# EAGLE design controller v3 (EAGLE 6.4)
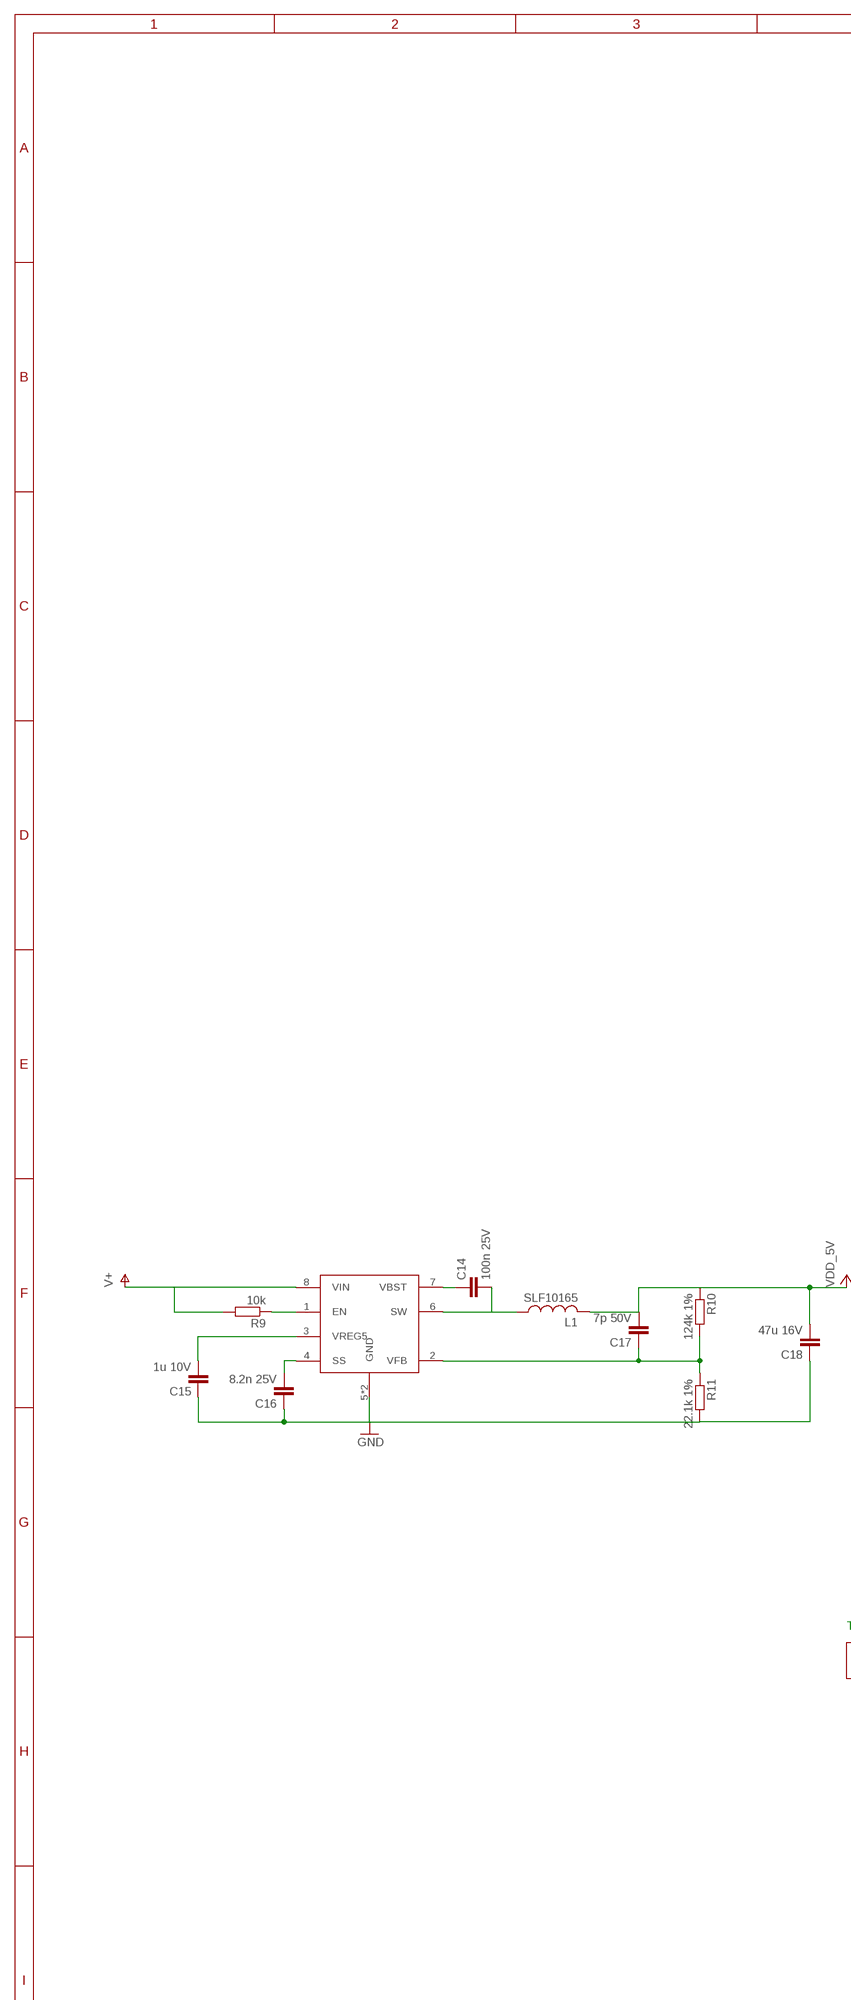
[diagram p0: schematic, sheet 1, part 1 of 2]
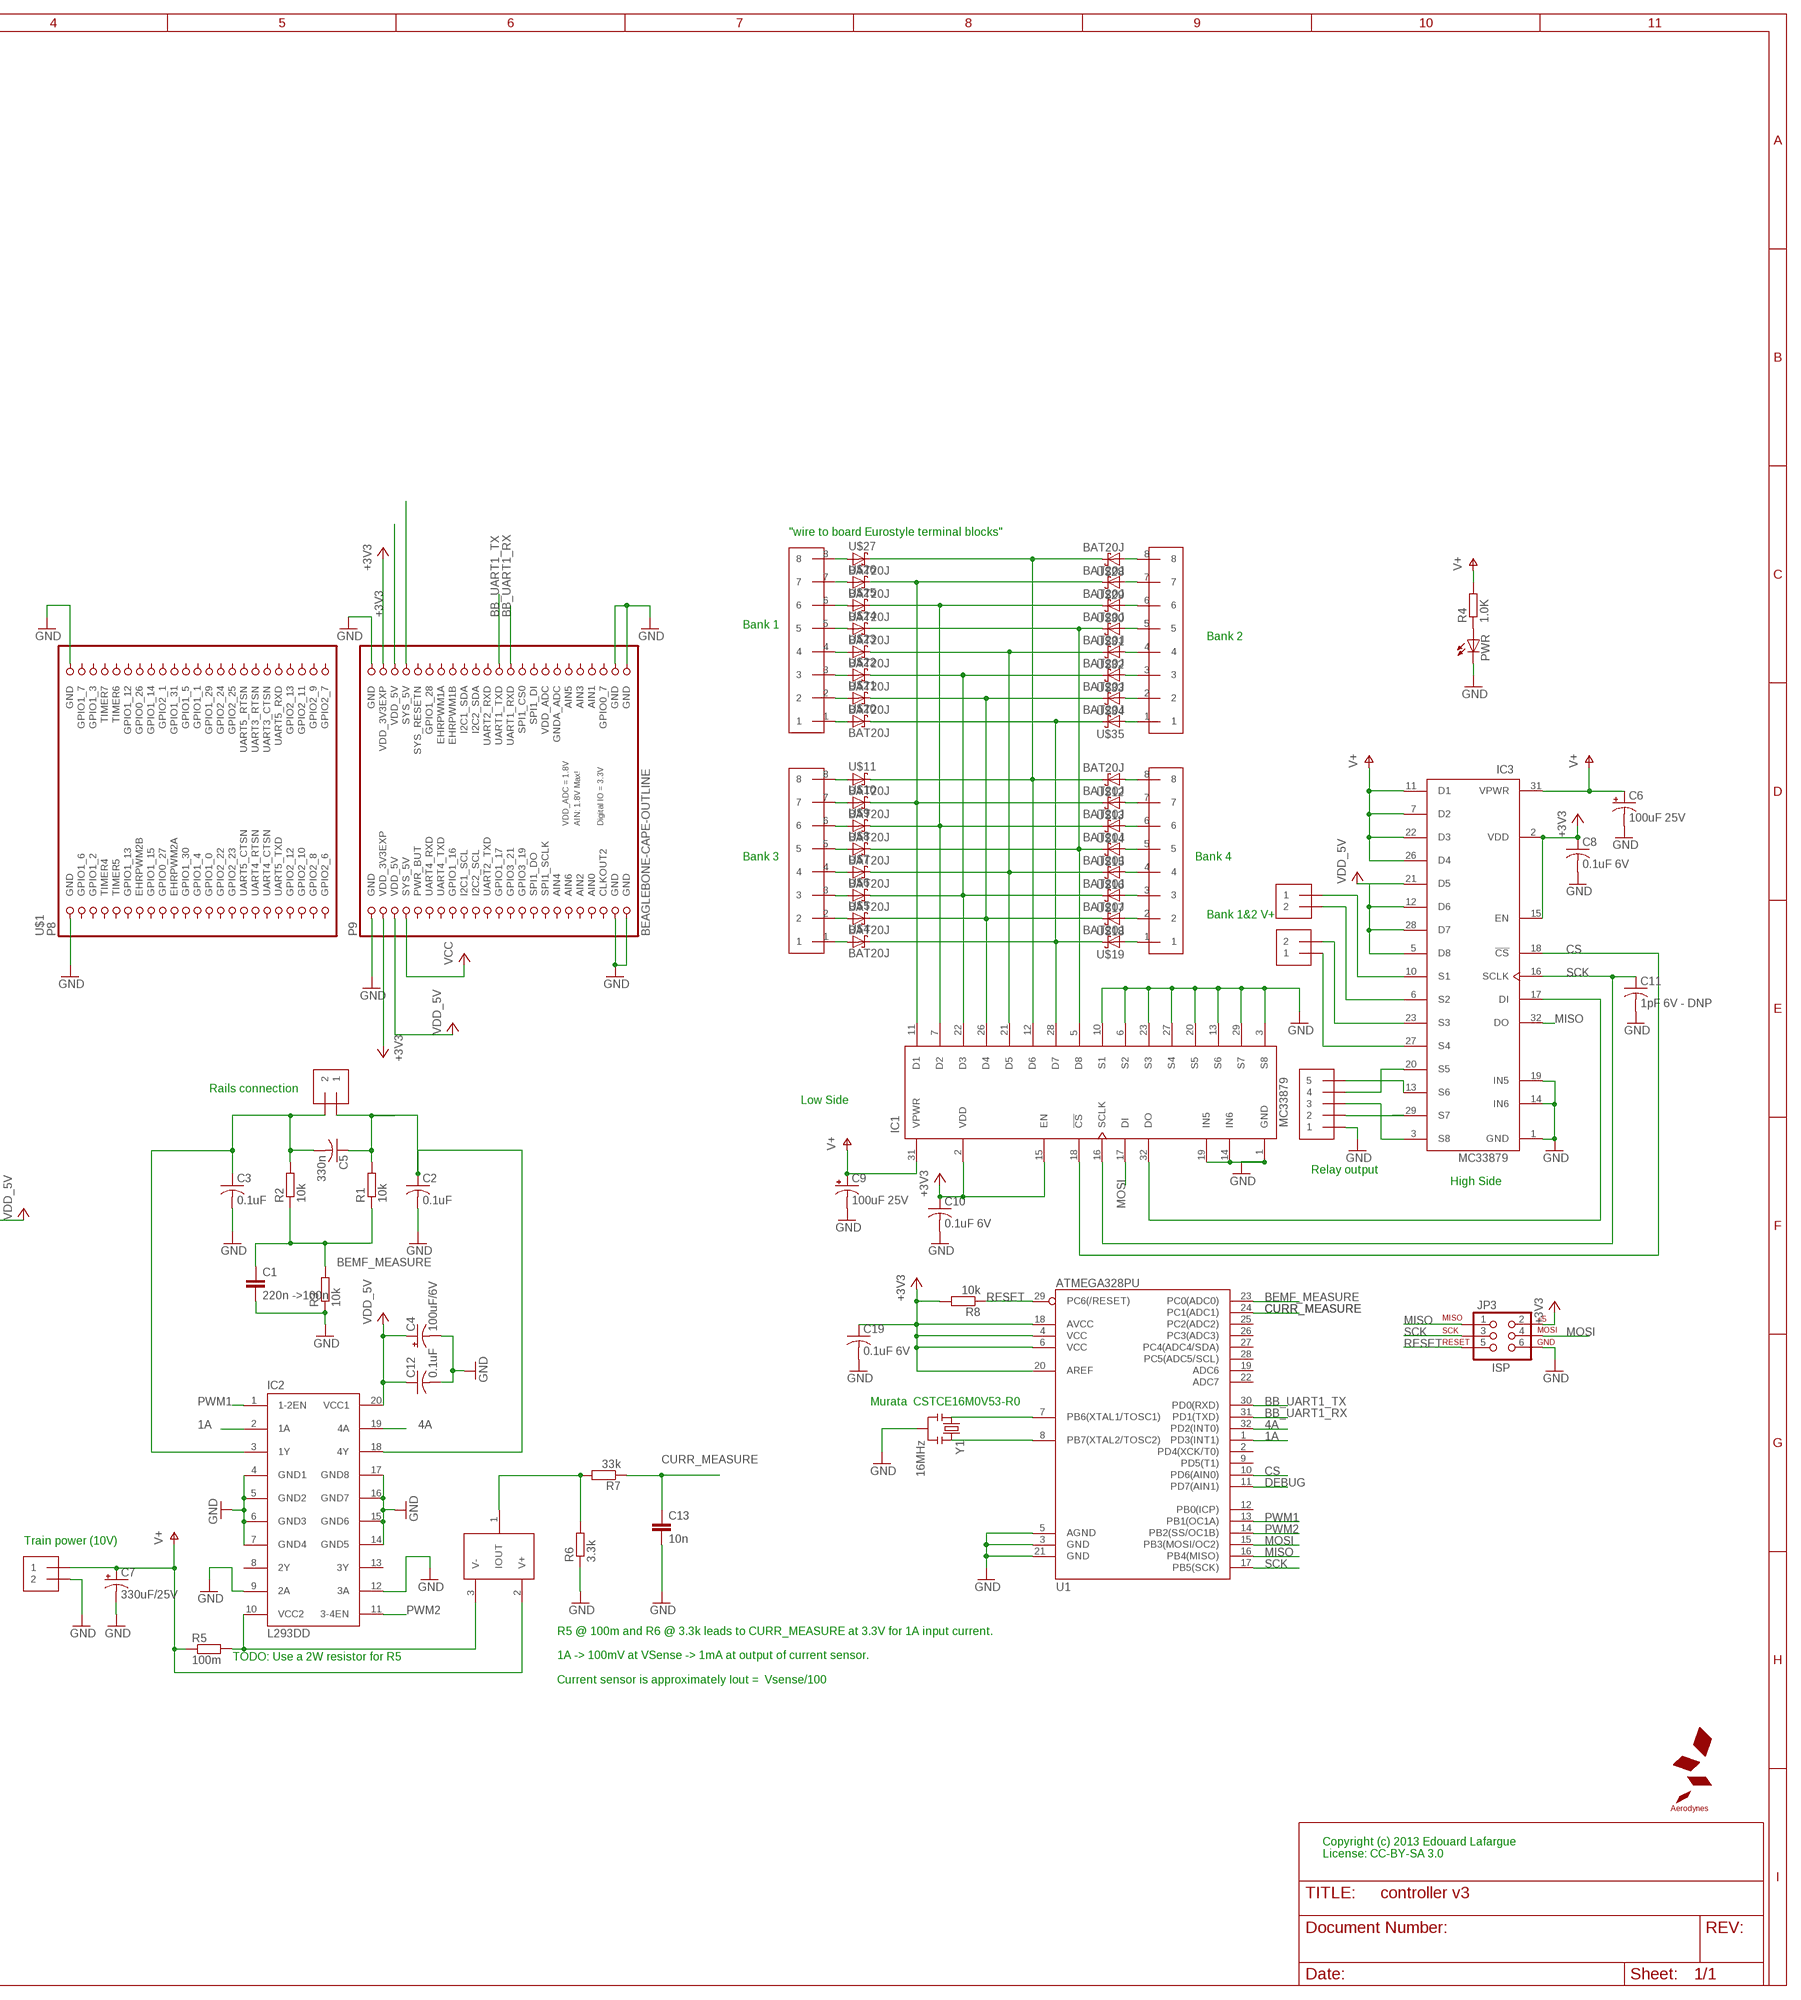
[diagram p1: schematic, sheet 1, part 2 of 2]

## Parts
BANK12  1X2-3.5MM  [1X2-3.5MM]
BANK34  1X2-3.5MM  [1X2-3.5MM]
C1  220n ->100n  C-EUC0805  [C0805]
C2  0.1uF  C-US025-025X050  [C025-025X050]
C3  0.1uF  C-US025-025X050  [C025-025X050]
C4  100uF/6V  CPOL-USE2.5-5  [E2,5-5]
C5  330n  C-US050-025X075  [C050-025X075]
C6  100uF 25V  CPOL-USE2,5-6E  [E2,5-6E]
C7  330uF/25V  CPOL-USE3.5-8  [E3,5-8]
C8  0.1uF 6V  C-US025-025X050  [C025-025X050]
C9  100uF 25V  CPOL-USE2,5-6E  [E2,5-6E]
C10  0.1uF 6V  C-US025-025X050  [C025-025X050]
C11  1pF 6V - DNP  C-USC0805K  [C0805K]
C12  0.1uF  C-US025-025X050  [C025-025X050]
C13  10n  C-EUC0805K  [C0805K]
C14  100n 25V  C-EUC0805K  [C0805K]
C15  1u 10V  C-EUC0603K  [C0603K]
C16  8.2n 25V  C-EUC0603K  [C0603K]
C17  7p 50V  C-EUC0805K  [C0805K]
C18  47u 16V  C-EUC1210K  [C1210K]
C19  0.1uF 6V  C-USC0603K  [C0603K]
CON1  1X08-CONN3.5MM  [1X08-3.5MM]
CON2  1X08-CONN3.5MM  [1X08-3.5MM]
CON3  1X08-CONN3.5MM  [1X08-3.5MM]
CON4  1X08-CONN3.5MM  [1X08-3.5MM]
CUR_SENSE  ZXCT1009-F  [SOT23-1TOP]
IC1  MC33879  [32SOICW-EP-065PITCH]
IC2  L293DD  [SOIC20-2]
IC3  MC33879  [32SOICW-EP-065PITCH]
J1  1X5  [1X05-3.5MM]
JP3  ISP  AVR_SPI_PRG_6PTH  [2X3]
L1  SLF10165  [SLF10165]
PWR  LED3MM  [LED3MM]
R1  10k  R-EU_R0603  [R0603]
R2  10k  R-EU_R0603  [R0603]
R3  10k  R-EU_R0603  [R0603]
R4  1.0K  R-EU_R0603  [R0603]
R5  100m  R-EU_M1206  [M1206]
R6  3.3k  R-EU_R0603  [R0603]
R7  33k  R-EU_R0603  [R0603]
R8  10k  R-EU_R0603  [R0603]
R9  10k  R-EU_R0603  [R0603]
R10  124k 1%  R-EU_R0603  [R0603]
R11  22.1k 1%  R-EU_R0603  [R0603]
SL1  1X2-3.5MM  [1X2-3.5MM]
SL2  1X2-3.5MM  [1X2-3.5MM]
U1  ATMEGA328PU  ATMEGA168  [TQFP32-08]
U$1  BEAGLEBONE-CAPE-OUTLINE  [BEAGLEBONE_NOCUT]
U$2  LOGO-AERODYNESSMALL  [LOGO-AERODYNES-S]
U$4  BAT20J  DIODE-SCHOTTKYSOD-323F  [SOD-323F]
U$5  BAT20J  DIODE-SCHOTTKYSOD-323F  [SOD-323F]
U$6  BAT20J  DIODE-SCHOTTKYSOD-323F  [SOD-323F]
U$7  BAT20J  DIODE-SCHOTTKYSOD-323F  [SOD-323F]
U$8  BAT20J  DIODE-SCHOTTKYSOD-323F  [SOD-323F]
U$9  BAT20J  DIODE-SCHOTTKYSOD-323F  [SOD-323F]
U$10  BAT20J  DIODE-SCHOTTKYSOD-323F  [SOD-323F]
U$11  BAT20J  DIODE-SCHOTTKYSOD-323F  [SOD-323F]
U$12  BAT20J  DIODE-SCHOTTKYSOD-323F  [SOD-323F]
U$13  BAT20J  DIODE-SCHOTTKYSOD-323F  [SOD-323F]
U$14  BAT20J  DIODE-SCHOTTKYSOD-323F  [SOD-323F]
U$15  BAT20J  DIODE-SCHOTTKYSOD-323F  [SOD-323F]
U$16  BAT20J  DIODE-SCHOTTKYSOD-323F  [SOD-323F]
U$17  BAT20J  DIODE-SCHOTTKYSOD-323F  [SOD-323F]
U$18  BAT20J  DIODE-SCHOTTKYSOD-323F  [SOD-323F]
U$19  BAT20J  DIODE-SCHOTTKYSOD-323F  [SOD-323F]
U$20  BAT20J  DIODE-SCHOTTKYSOD-323F  [SOD-323F]
U$21  BAT20J  DIODE-SCHOTTKYSOD-323F  [SOD-323F]
U$22  BAT20J  DIODE-SCHOTTKYSOD-323F  [SOD-323F]
U$23  BAT20J  DIODE-SCHOTTKYSOD-323F  [SOD-323F]
U$24  BAT20J  DIODE-SCHOTTKYSOD-323F  [SOD-323F]
U$25  BAT20J  DIODE-SCHOTTKYSOD-323F  [SOD-323F]
U$26  BAT20J  DIODE-SCHOTTKYSOD-323F  [SOD-323F]
U$27  BAT20J  DIODE-SCHOTTKYSOD-323F  [SOD-323F]
U$28  BAT20J  DIODE-SCHOTTKYSOD-323F  [SOD-323F]
U$29  BAT20J  DIODE-SCHOTTKYSOD-323F  [SOD-323F]
U$30  BAT20J  DIODE-SCHOTTKYSOD-323F  [SOD-323F]
U$31  BAT20J  DIODE-SCHOTTKYSOD-323F  [SOD-323F]
U$32  BAT20J  DIODE-SCHOTTKYSOD-323F  [SOD-323F]
U$33  BAT20J  DIODE-SCHOTTKYSOD-323F  [SOD-323F]
U$34  BAT20J  DIODE-SCHOTTKYSOD-323F  [SOD-323F]
U$35  BAT20J  DIODE-SCHOTTKYSOD-323F  [SOD-323F]
U$36  TPS54327DDA  [SOIC8-DDA]
Y1  16MHz  RESONATOR16MHZ  [RESONATOR-SMD]

## Nets
1A: IC2.2(1A) U1.1(PD3(INT1))
1Y: C3.1 C5.2 IC2.3(1Y) R2.2 SL1.2
4A: IC2.19(4A) U1.32(PD2(INT0))
4Y: C2.1 C5.1 IC2.18(4Y) R1.2 SL1.1
+3V3: C8.1 C10.1 C19.1 IC1.2(VDD) IC1.15(EN) IC3.2(VDD) IC3.15(EN) JP3.2 R8.2 U1.4(VCC) U1.6(VCC) U1.18(AVCC) U1.20(AREF) U$1.P9-3(VDD_3V3EXP) U$1.P9-4(VDD_3V3EXP)
BB_UART1_RX: U1.31(PD1(TXD)) U$1.P9-26(UART1_RXD)
BB_UART1_TX: U1.30(PD0(RXD)) U$1.P9-24(UART1_TXD)
BEMF_MEASURE: C1.1 R1.1 R2.1 R3.2 U1.23(PC0(ADC0))
CS: IC1.18(!CS) IC3.18(!CS) U1.10(PD6(AIN0))
CURR_MEASURE: C13.1 R7.1 U1.24(PC1(ADC1))
DEBUG: U1.11(PD7(AIN1))
GND: C1.2 C2.2 C3.2 C4.- C6.- C7.- C8.2 C9.- C10.2 C11.2 C12.2 C13.2 C15.1 C16.1 C18.1 C19.2 IC1.1(GND) IC1.3(S8) IC1.6(S2) IC1.10(S1) IC1.13(S6) IC1.14(IN6) IC1.19(IN5) IC1.20(S5) IC1.23(S3) IC1.27(S4) IC1.29(S7) IC2.4(GND1) IC2.5(GND2) IC2.6(GND3) IC2.7(GND4) IC2.9(2A) IC2.12(3A) IC2.14(GND5) IC2.15(GND6) IC2.16(GND7) IC2.17(GND8) IC3.1(GND) IC3.14(IN6) IC3.19(IN5) J1.1 JP3.6 PWR.K(C) R3.1 R6.1 R11.2 SL2.2 U1.3(GND) U1.5(AGND) U1.21(GND) U$1.P8-1(GND) U$1.P8-2(GND) U$1.P9-1(GND) U$1.P9-2(GND) U$1.P9-43(GND) U$1.P9-44(GND) U$1.P9-45(GND) U$1.P9-46(GND) U$36.5(GND) U$36.PAD(GND) Y1.2
MISO: IC3.32(DO) JP3.1 U1.16(PB4(MISO))
MOSI: IC1.17(DI) JP3.4 U1.15(PB3(MOSI/OC2))
N$1: BANK34.1 IC3.27(S4)
N$2: BANK34.2 IC3.23(S3)
N$3: BANK12.2 IC3.6(S2)
N$4: BANK12.1 IC3.10(S1)
N$5: CUR_SENSE.3(V-) IC2.10(VCC2) R5.2
N$6: CUR_SENSE.1(IOUT) R6.2 R7.2
N$7: IC1.22(D3) U$6.C U$17.C U$22.C U$33.C
N$8: IC1.21(D5) U$7.C U$16.C U$23.C U$32.C
N$9: IC1.5(D8) U$8.C U$15.C U$24.C U$31.C
N$10: CON3.3 U$6.A
N$11: IC1.28(D7) U$4.C U$19.C U$20.C U$35.C
N$12: IC1.12(D6) U$11.C U$12.C U$27.C U$28.C
N$13: IC1.32(DO) IC3.17(DI)
N$14: IC1.11(D1) U$10.C U$13.C U$26.C U$29.C
N$15: IC1.26(D4) U$5.C U$18.C U$21.C U$34.C
N$16: IC1.7(D2) U$9.C U$14.C U$25.C U$30.C
N$17: IC3.20(S5) J1.4
N$18: CON3.2 U$5.A
N$19: CON3.1 U$4.A
N$20: CON3.8 U$11.A
N$21: CON3.7 U$10.A
N$22: CON3.6 U$9.A
N$23: CON3.5 U$8.A
N$24: CON3.4 U$7.A
N$25: CON4.8 U$12.A
N$26: CON4.7 U$13.A
N$27: CON4.6 U$14.A
N$28: CON4.5 U$15.A
N$29: CON4.4 U$16.A
N$30: CON4.3 U$17.A
N$31: CON4.2 U$18.A
N$32: CON4.1 U$19.A
N$33: CON1.8 U$27.A
N$34: CON1.7 U$26.A
N$35: PWR.A R4.1
N$36: CON1.6 U$25.A
N$37: CON1.5 U$24.A
N$38: CON1.4 U$23.A
N$39: CON1.3 U$22.A
N$40: CON1.2 U$21.A
N$41: CON1.1 U$20.A
N$42: CON2.8 U$28.A
N$43: CON2.7 U$29.A
N$44: CON2.6 U$30.A
N$45: CON2.5 U$31.A
N$46: CON2.4 U$32.A
N$47: CON2.3 U$33.A
N$48: CON2.2 U$34.A
N$49: CON2.1 U$35.A
N$50: IC3.13(S6) J1.5
N$53: IC3.29(S7) J1.2
N$54: IC3.3(S8) J1.3
N$55: U1.7(PB6(XTAL1/TOSC1)) Y1.1
N$56: U1.8(PB7(XTAL2/TOSC2)) Y1.3
N$58: R9.1 U$36.1(EN)
N$59: C14.1 U$36.7(VBST)
N$60: C16.2 U$36.4(SS)
N$61: C14.2 L1.P$1 U$36.6(SW)
N$63: C15.2 U$36.3(VREG5)
N$65: C17.1 R10.2 R11.1 U$36.2(VFB)
PWM1: IC2.1(1-2EN) U1.13(PB1(OC1A))
PWM2: IC2.11(3-4EN) U1.14(PB2(SS/OC1B))
RESET: JP3.5 R8.1 U1.29(PC6(/RESET))
SCK: C11.1 IC1.16(SCLK) IC3.16(SCLK) JP3.3 U1.17(PB5(SCK))
SYS_5V: U$1.P9-7(SYS_5V) U$1.P9-8(SYS_5V) ; supply symbol labelled VCC
V+: C6.+ C7.+ C9.+ CUR_SENSE.2(V+) IC1.31(VPWR) IC3.7(D2) IC3.11(D1) IC3.22(D3) IC3.26(D4) IC3.31(VPWR) R4.2 R5.1 R9.2 SL2.1 U$36.8(VIN)
VDD_5V: C4.+ C12.1 C17.2 C18.2 IC2.20(VCC1) IC3.5(D8) IC3.12(D6) IC3.21(D5) IC3.28(D7) L1.P$2 R10.1 U$1.P9-5(VDD_5V) U$1.P9-6(VDD_5V)
Unconnected: IC2.8(2Y) IC2.13(3Y) U1.2(PD4(XCK/T0)) U1.9(PD5(T1)) U1.12(PB0(ICP)) U1.19(ADC6) U1.22(ADC7) U1.25(PC2(ADC2)) U1.26(PC3(ADC3)) U1.27(PC4(ADC4/SDA)) U1.28(PC5(ADC5/SCL)) U$1.P8-3(GPIO1_6) U$1.P8-4(GPIO1_7) U$1.P8-5(GPIO1_2) U$1.P8-6(GPIO1_3) U$1.P8-7(TIMER4) U$1.P8-8(TIMER7) U$1.P8-9(TIMER5) U$1.P8-10(TIMER6) U$1.P8-11(GPIO1_13) U$1.P8-12(GPIO1_12) U$1.P8-13(EHRPWM2B) U$1.P8-14(GPIO0_26) U$1.P8-15(GPIO1_15) U$1.P8-16(GPIO1_14) U$1.P8-17(GPIO0_27) U$1.P8-18(GPIO2_1) U$1.P8-19(EHRPWM2A) U$1.P8-20(GPIO1_31) U$1.P8-21(GPIO1_30) U$1.P8-22(GPIO1_5) U$1.P8-23(GPIO1_4) U$1.P8-24(GPIO1_1) U$1.P8-25(GPIO1_0) U$1.P8-26(GPIO1_29) U$1.P8-27(GPIO2_22) U$1.P8-28(GPIO2_24) U$1.P8-29(GPIO2_23) U$1.P8-30(GPIO2_25) U$1.P8-31(UART5_CTSN) U$1.P8-32(UART5_RTSN) U$1.P8-33(UART4_RTSN) U$1.P8-34(UART3_RTSN) U$1.P8-35(UART4_CTSN) U$1.P8-36(UART3_CTSN) U$1.P8-37(UART5_TXD) U$1.P8-38(UART5_RXD) U$1.P8-39(GPIO2_12) U$1.P8-40(GPIO2_13) U$1.P8-41(GPIO2_10) U$1.P8-42(GPIO2_11) U$1.P8-43(GPIO2_8) U$1.P8-44(GPIO2_9) U$1.P8-45(GPIO2_6) U$1.P8-46(GPIO2_7) U$1.P9-9(PWR_BUT) U$1.P9-10(SYS_RESETN) U$1.P9-11(UART4_RXD) U$1.P9-12(GPIO1_28) U$1.P9-13(UART4_TXD) U$1.P9-14(EHRPWM1A) U$1.P9-15(GPIO1_16) U$1.P9-16(EHRPWM1B) U$1.P9-17(I2C1_SCL) U$1.P9-18(I2C1_SDA) U$1.P9-19(I2C2_SCL) U$1.P9-20(I2C2_SDA) U$1.P9-21(UART2_TXD) U$1.P9-22(UART2_RXD) U$1.P9-23(GPIO1_17) U$1.P9-25(GPIO3_21) U$1.P9-27(GPIO3_19) U$1.P9-28(SPI1_CS0) U$1.P9-29(SPI1_DO) U$1.P9-30(SPI1_DI) U$1.P9-31(SPI1_SCLK) U$1.P9-33(AIN4) U$1.P9-35(AIN6) U$1.P9-36(AIN5) U$1.P9-37(AIN2) U$1.P9-38(AIN3) U$1.P9-39(AIN0) U$1.P9-40(AIN1) U$1.P9-41(CLKOUT2) U$1.P9-42(GPIO0_7)

## Notes on the sheet
- "wire to board Eurostyle terminal blocks"
- Bank 1
- Bank 2
- Bank 3 | Bank 4
- Bank 1&2 V+
- Rails connection
- Low Side
- Relay output
- High Side
- Murata  CSTCE16M0V53-R0
- Train power (10V)
- TODO: Use a 2W resistor for R5
- R5 @ 100m and R6 @ 3.3k leads to CURR_MEASURE at 3.3V for 1A input current.
  
  1A -> 100mV at VSense -> 1mA at output of current sensor.
  
  Current sensor is approximately Iout = 	Vsense/100
- Copyright (c) 2013 Edouard Lafargue
  License: CC-BY-SA 3.0

## Power pins joined to a net without a drawn wire
GNDA_ADC: U$1.P9-34(GNDA_ADC)
VDD_ADC: U$1.P9-32(VDD_ADC)

## Library data of the parts
BANK12 BANK34 SL1 SL2 = adafruit:1X2: 3.5mm Terminal block http://www.ladyada.net/library/pcb/eaglelibrary.html
C1 C13-C18 = resistor:C-EU: CAPACITOR, European symbol
C2 C3 C8 C10-C12 C19 = rcl-ez:C-US: CAPACITOR, American symbol
C4 = adafruit:CPOL-US: POLARIZED CAPACITOR, American symbol
C5 = adafruit:C-US: CAPACITOR, American symbol
C6 C9 = rcl:CPOL-US: POLARIZED CAPACITOR, American symbol
C7 = rcl-ez:CPOL-US: POLARIZED CAPACITOR, American symbol
CON1-CON4 = aerodynes:1X08-CONN: Generic 3.5mm pitch screw connector, 8 plots.
CUR_SENSE = aerodynes:ZXCT1009: The ZXCT1009 is a high side current sense monitor. Using this device eliminates the need to disrupt the ground plane when sensing a load current. It takes a high side voltage developed across a current shunt resistor and translates it into a proportional output current. A user defined output resistor scales the output current into a ground-referenced voltage. The wide input voltage range of 20V down to as low as 2.5V make it suitable for a range of applications. A minimum operating current of just 4µA, combined with a SOT23 package make it a unique solution for portable battery equipment. The SM8 device offers an alternative package option. http://www.diodes.com/datasheets/ZXCT1009.pdf
IC1 IC3 = aerodynes:MC33879
IC2 = aerodynes:L293D: The Device is a monolithic integrated high voltage, high current four channel driver designed to accept standard DTL or TTL logic levels and drive inductive loads (such as relays solenoides, DC and stepping motors) and switching power transistors. To simplify use as two bridges each pair of channels is equipped with an enable input. A separate supply input is provided for the logic, allowing operation at a lower voltage and internal clamp diodes are included. This device is suitable for use in switching applications at frequencies up to 5 kHz.
J1 = adafruit:1X5
JP3 = SparkFun:AVR_SPI_PRG_6: AVR ISP 6 Pin This is the reduced ISP connector for AVR programming. Common on Arduino. This footprint will take up less PCB space and can be used with a 10-pin to 6-pin adapter such as SKU: BOB-08508
L1 = aerodynes:SLF10165
PWR = minimidi:LED: LED OSRAM: - CHIPLED LG R971, LG N971, LY N971, LG Q971, LY Q971, LO R971, LY R971 LH N974, LH R974 LS Q976, LO Q976, LY Q976 LO Q996 - Hyper CHIPLED LW Q18S LB Q993, LB Q99A, LB R99A - SideLED LS A670, LO A670, LY A670, LG A670, LP A670 LB A673, LV A673, LT A673, LW A673 LH A674 LY A675 LS A676, LA A676, LO A676, LY A676, LW A676 LS A679, LY A679, LG A679 - Hyper Micro SIDELED® LS Y876, LA Y876, LO Y876, LY Y876 LT Y87S - SmartLED LW L88C, LW L88S LB L89C, LB L89S, LG L890 LS L89K, LO L89K, LY L89K LS L896, LA L896, LO L896, LY L896 - TOPLED LS T670, LO T670, LY T670, LG T670, LP T670 LSG T670, LSP T670, LSY T670, LOP T670, LYG T670 LG T671, LOG T671, LSG T671 LB T673, LV T673, LT T673, LW T673 LH T674 LS T676, LA T676, LO T676, LY T676, LB T676, LH T676, LSB T676, LW T676 LB T67C, LV T67C, LT T67C, LS T67K, LO T67K, LY T67K, LW E67C LS E67B, LA E67B, LO E67B, LY E67B, LB E67C, LV E67C, LT E67C LW T67C LS T679, LY T679, LG T679 LS T770, LO T770, LY T770, LG T770, LP T770 LB T773, LV T773, LT T773, LW T773 LH T774 LS E675, LA E675, LY E675, LS T675 LS T776, LA T776, LO T776, LY T776, LB T776 LHGB T686 LT T68C, LB T68C - Hyper Mini TOPLED® LB M676 - Mini TOPLED Santana® LG M470 LS M47K, LO M47K, LY M47K Source: http://www.osram.convergy.de/
R1-R11 = resistor:R-EU_: RESISTOR, European symbol
U1 = SparkFun:ATMEGA168
U$1 = aerodynes:BEAGLEBONE-CAPE
U$2 = aerodynes:LOGO-AERODYNES
U$4-U$35 = aerodynes:DIODE-SCHOTTKY: Various Schottky diodes used in Aerodynes projects
U$36 = aerodynes:TPS54327: 3-A OUTPUT SINGLE SYNCHRONOUS STEP DOWN SWITCHER WITH INTEGRATED FET (SWIFTTM ) The TPS54327 is an adaptive on-time D-CAP2™ mode synchronous buck converter.
Y1 = SparkFun-FreqCtrl:RESONATOR: Resonator Small SMD resonator. Used, eg, on the Arduino Pro/ Pro Mini boards. 8MHz- XTAL-08895 16MHz- XTAL-08900; PROD_ID: XTAL-08900

## Net classes
0 Default: width 0.254 mm
1 power: width 0.61 mm

## Board
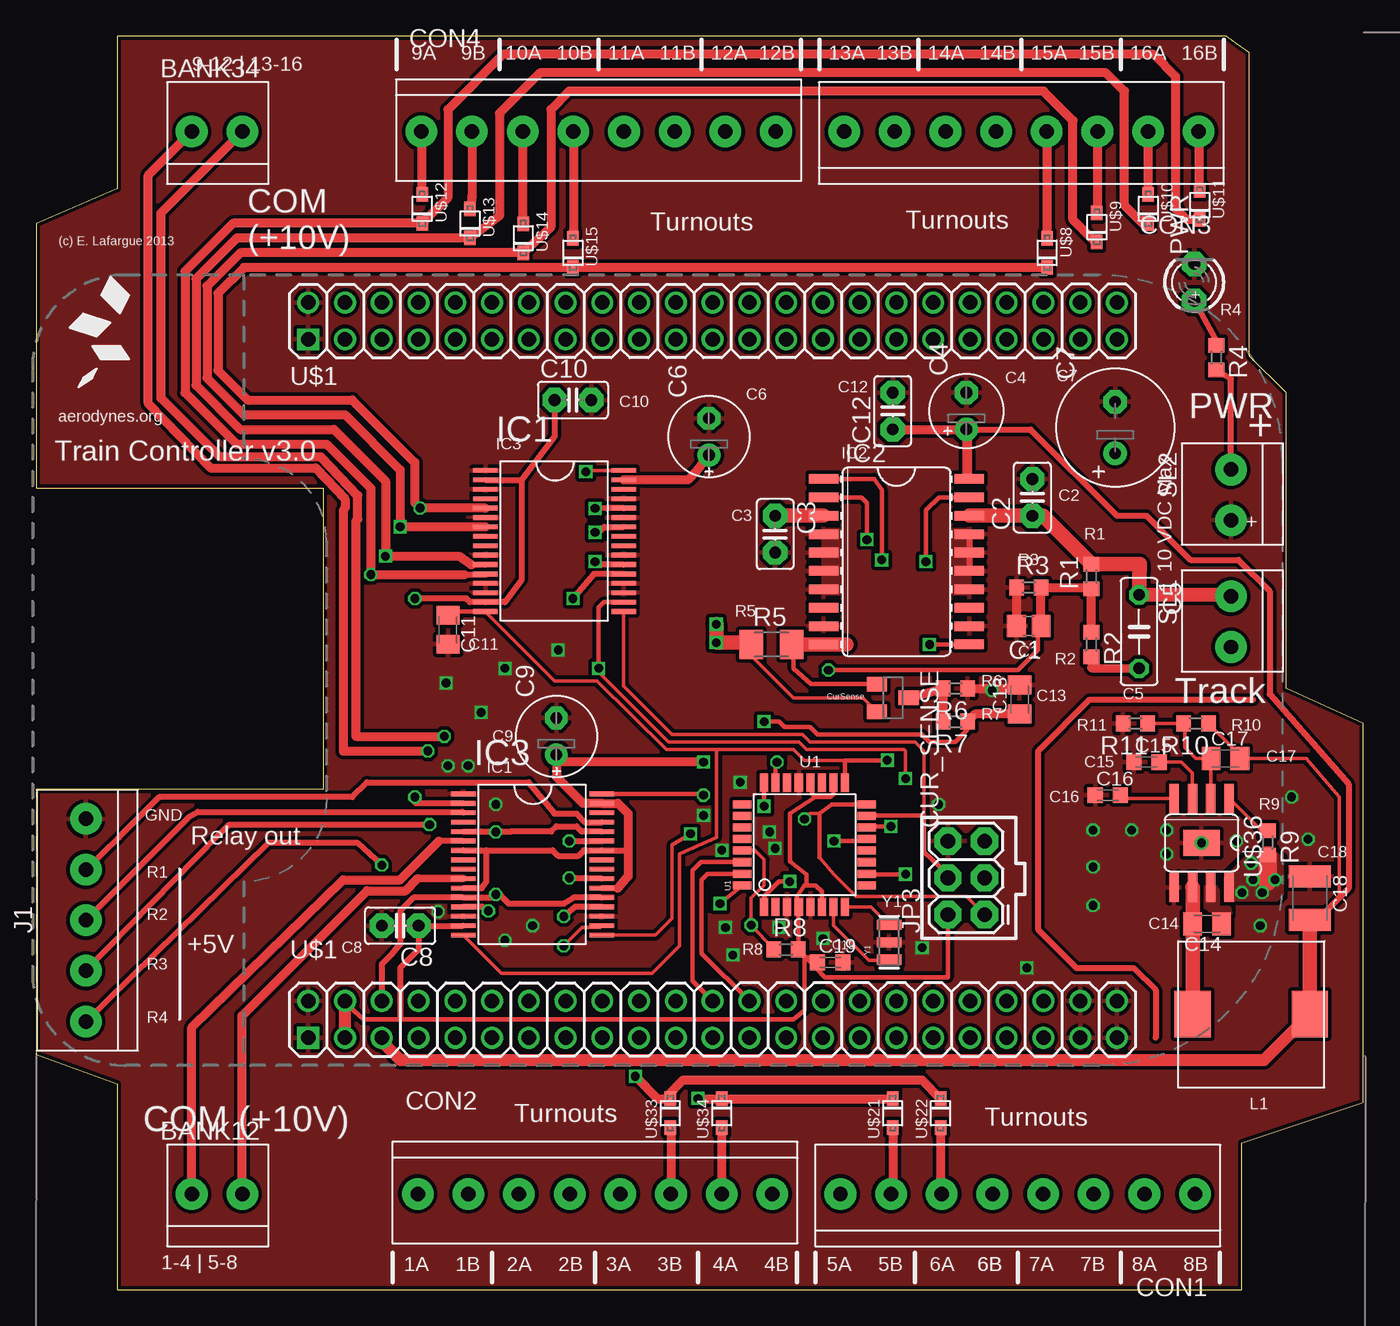
[diagram p2: board, top side]
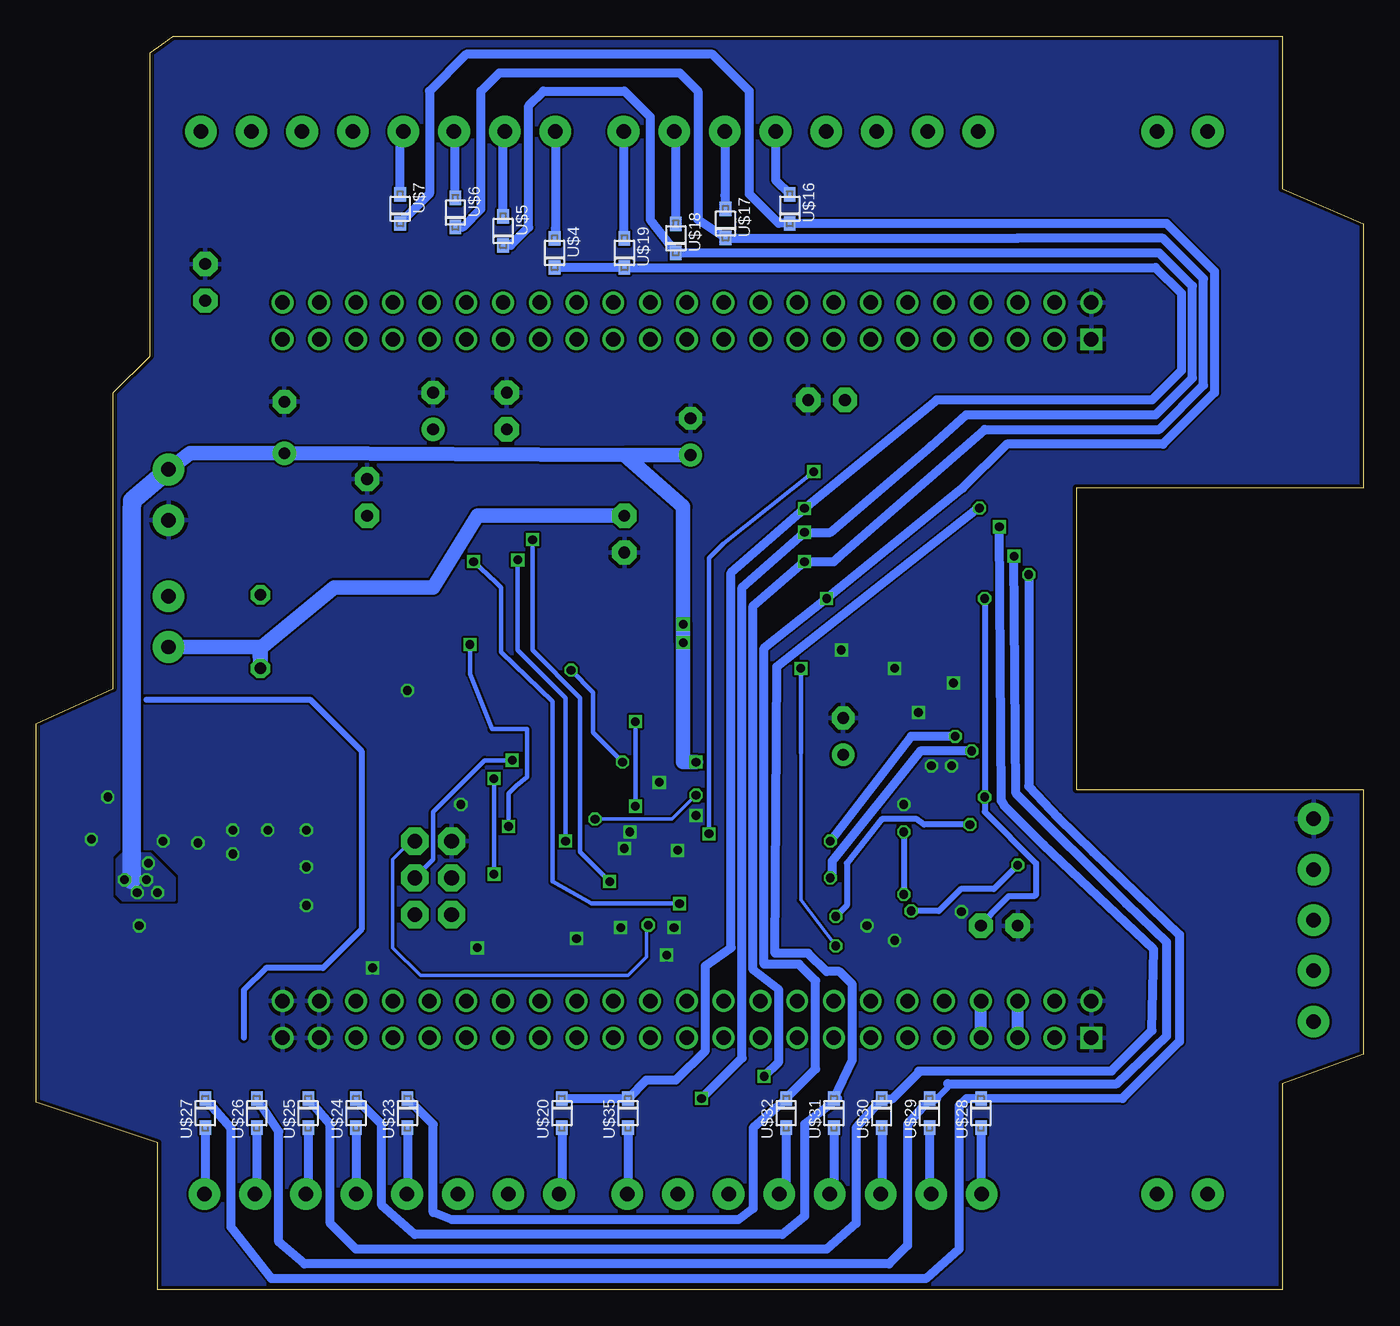
[diagram p3: board, bottom side, seen from below]

Size 91.69 x 86.6 mm. Coordinates in mm from the lower left corner, seen from the top.
Outline: 5.59,0 83.31,0 83.31,10.16 91.69,12.95 91.69,39.12 86.36,41.53 86.36,61.98 83.82,64.52 83.82,85.47 82.98,86.05 82.22,86.6 5.59,86.6 5.59,76.07 0,73.66 0,55.37 19.81,55.37 19.81,34.54 0,34.54 0,16.26 5.59,14.22 5.59,0
Copper layers (1*16): Top 0.035mm / dielectric 1.5mm / Bottom 0.035mm
Design rules "Fusion_eagle_rule_v1.1": minimum track width 6mil, minimum drill 12mil, track to track 6mil, track to pad 6mil, pad to pad 6mil, via to via 6mil, smd to smd 0mil, copper to edge 10mil, drill to drill 10mil, minimum pad ring 10mil, minimum via ring 6mil, stop-mask expansion 2mil, vias tented up to drill 100mil, thermal gap 10mil

### Footprints (pad centres in the part's own frame; a part is rotated, then mirrored left to right if it is on the bottom)
1X2-3.5MM = drill 1 pad 2.184: 1 1.8,0; 2 -1.7,0
C0805 = smd 1.3 x 1.5: 1 -0.85,0; 2 0.85,0
C025-025X050 = drill 0.813 pad 1.676 octagon: 1 -1.27,0; 2 1.27,0
E2,5-5 = drill 0.813 pad 1.6: + -1.27,0 | drill 0.813 pad 1.6 octagon: - 1.27,0
C050-025X075 = drill 0.813 octagon: 1 -2.54,0; 2 2.54,0
E2,5-6E = drill 0.813 pad 1.575: + -1.27,0 | drill 0.813 pad 1.575 octagon: - 1.27,0
E3,5-8 = drill 0.813 pad 1.6: + -1.778,0 | drill 0.813 pad 1.6 octagon: - 1.778,0
C0805K = smd 1.3 x 1.6: 1 -1,0; 2 1,0
C0603K = smd 1.05 x 1.08: 1 -0.875,0; 2 0.875,0
C1210K = smd 1.5 x 2.9: 1 -1.5,0; 2 1.5,0
1X08-3.5MM = drill 1 pad 2.184: 1 -12.25,0; 2 -8.75,0; 3 -5.25,0; 4 -1.75,0; 5 1.75,0; 6 5.25,0; 7 8.75,0; 8 12.25,0
SOT23-1TOP = smd 1 x 1.4: 1 0,1.1; 2 0.95,-1.1; 3 -0.95,-1.1
32SOICW-EP-065PITCH = smd 0.325 x 1.7: 1 -9.1,-4.78; 2 -8.45,-4.78; 3 -7.8,-4.78; 4 -7.15,-4.78; 5 -6.5,-4.78; 6 -5.85,-4.78; 7 -5.2,-4.78; 8 -4.55,-4.78; 9 -3.9,-4.78; 10 -3.25,-4.78; 11 -2.6,-4.78; 12 -1.95,-4.78; 13 -1.3,-4.78; 14 -0.65,-4.78; 15 0,-4.78; 16 0.65,-4.78; 17 0.65,4.78; 18 0,4.78; 19 -0.65,4.78; 20 -1.3,4.78; 21 -1.95,4.78; 22 -2.6,4.78; 23 -3.25,4.78; 24 -3.9,4.78; 25 -4.55,4.78; 26 -5.2,4.78; 27 -5.85,4.78; 28 -6.5,4.78; 29 -7.15,4.78; 30 -7.8,4.78; 31 -8.45,4.78; 32 -9.1,4.78
SOIC20-2 = smd 0.66 x 2.032: 1 -5.715,-5.029; 2 -4.445,-5.029; 3 -3.175,-5.029; 4 -1.905,-5.029; 5 -0.635,-5.029; 6 0.635,-5.029; 7 1.905,-5.029; 8 3.175,-5.029; 9 4.445,-5.029; 10 5.715,-5.029; 11 5.715,5.029; 12 4.445,5.029; 13 3.175,5.029; 14 1.905,5.029; 15 0.635,5.029; 16 -0.635,5.029; 17 -1.905,5.029; 18 -3.175,5.029; 19 -4.445,5.029; 20 -5.715,5.029
1X05-3.5MM = drill 1 pad 2.184: 1 7,0; 2 3.5,0; 3 0,0; 4 -3.5,0; 5 -7,0
2X3 = drill 1.016 pad 1.88 octagon: 1 0,0; 2 0,2.54; 3 2.54,0; 4 2.54,2.54; 5 5.08,0; 6 5.08,2.54
SLF10165 = smd 2.5 x 3.2: P$1 -1,1.5; P$2 7.1,1.5
LED3MM = drill 0.813 pad 1.676 octagon: A -1.27,0; K 1.27,0
R0603 = smd 1 x 1.1: 1 -0.85,0; 2 0.85,0
M1206 = smd 1.6 x 2: 1 -1.4,0; 2 1.4,0
TQFP32-08 = smd 1.27 x 0.559: 1 -4.293,2.8; 2 -4.293,2; 3 -4.293,1.2; 4 -4.293,0.4; 5 -4.293,-0.4; 6 -4.293,-1.2; 7 -4.293,-2; 8 -4.293,-2.8; 17 4.293,-2.8; 18 4.293,-2; 19 4.293,-1.2; 20 4.293,-0.4; 21 4.293,0.4; 22 4.293,1.2; 23 4.293,2; 24 4.293,2.8 | smd 0.559 x 1.27: 9 -2.8,-4.293; 10 -2,-4.293; 11 -1.2,-4.293; 12 -0.4,-4.293; 13 0.4,-4.293; 14 1.2,-4.293; 15 2,-4.293; 16 2.8,-4.293; 25 2.8,4.293; 26 2,4.293; 27 1.2,4.293; 28 0.4,4.293; 29 -0.4,4.293; 30 -1.2,4.293; 31 -2,4.293; 32 -2.8,4.293
BEAGLEBONE_NOCUT = drill 1 square: P8-1 19.05,50.165; P9-1 19.05,1.905 | drill 1: P8-2 19.05,52.705; P8-3 21.59,50.165; P8-4 21.59,52.705; P8-5 24.13,50.165; P8-6 24.13,52.705; P8-7 26.67,50.165; P8-8 26.67,52.705; P8-9 29.21,50.165; P8-10 29.21,52.705; P8-11 31.75,50.165; P8-12 31.75,52.705; P8-13 34.29,50.165; P8-14 34.29,52.705; P8-15 36.83,50.165; P8-16 36.83,52.705; P8-17 39.37,50.165; P8-18 39.37,52.705; P8-19 41.91,50.165; P8-20 41.91,52.705; P8-21 44.45,50.165; P8-22 44.45,52.705; P8-23 46.99,50.165; P8-24 46.99,52.705; P8-25 49.53,50.165; P8-26 49.53,52.705; P8-27 52.07,50.165; P8-28 52.07,52.705; P8-29 54.61,50.165; P8-30 54.61,52.705; P8-31 57.15,50.165; P8-32 57.15,52.705; P8-33 59.69,50.165; P8-34 59.69,52.705; P8-35 62.23,50.165; P8-36 62.23,52.705; P8-37 64.77,50.165; P8-38 64.77,52.705; P8-39 67.31,50.165; P8-40 67.31,52.705; P8-41 69.85,50.165; P8-42 69.85,52.705; P8-43 72.39,50.165; P8-44 72.39,52.705; P8-45 74.93,50.165; P8-46 74.93,52.705; P9-2 19.05,4.445; P9-3 21.59,1.905; P9-4 21.59,4.445; P9-5 24.13,1.905; P9-6 24.13,4.445; P9-7 26.67,1.905; P9-8 26.67,4.445; P9-9 29.21,1.905; P9-10 29.21,4.445; P9-11 31.75,1.905; P9-12 31.75,4.445; P9-13 34.29,1.905; P9-14 34.29,4.445; P9-15 36.83,1.905; P9-16 36.83,4.445; P9-17 39.37,1.905; P9-18 39.37,4.445; P9-19 41.91,1.905; P9-20 41.91,4.445; P9-21 44.45,1.905; P9-22 44.45,4.445; P9-23 46.99,1.905; P9-24 46.99,4.445; P9-25 49.53,1.905; P9-26 49.53,4.445; P9-27 52.07,1.905; P9-28 52.07,4.445; P9-29 54.61,1.905; P9-30 54.61,4.445; P9-31 57.15,1.905; P9-32 57.15,4.445; P9-33 59.69,1.905; P9-34 59.69,4.445; P9-35 62.23,1.905; P9-36 62.23,4.445; P9-37 64.77,1.905; P9-38 64.77,4.445; P9-39 67.31,1.905; P9-40 67.31,4.445; P9-41 69.85,1.905; P9-42 69.85,4.445; P9-43 72.39,1.905; P9-44 72.39,4.445; P9-45 74.93,1.905; P9-46 74.93,4.445
SOD-323F = smd 1 x 0.8: A -1,0; C 1,0
SOIC8-DDA = smd 0.66 x 2.032: 1 -1.905,-3.073; 2 -0.635,-3.073; 3 0.635,-3.073; 4 1.905,-3.073; 5 1.905,3.073; 6 0.635,3.073; 7 -0.635,3.073; 8 -1.905,3.073 | smd 2.54 x 1.778: PAD 0,0
RESONATOR-SMD = smd 0.7 x 1.7: 1 -1.2,0; 2 0,0; 3 1.2,0

### Placement (x,y rotation side)
BANK12  12.45,6.6 0 top
BANK34  12.45,80.01 0 top
C1  68.58,45.85 180 top
C2  68.83,54.74 90 top
C3  51.05,52.2 270 top
C4  64.26,60.71 90 top
C5  76.2,45.47 270 top
C6  46.48,58.93 90 top
C7  74.55,59.56 90 top
C8  25.15,25.15 180 top
C9  35.94,38.23 90 top
C10  37.08,61.47 0 top
C11  28.45,45.59 270 top
C12  59.18,60.71 90 top
C13  67.95,40.77 90 top
C14  80.9,25.27 180 top
C15  76.71,36.45 0 top
C16  74.04,34.16 0 top
C17  82.17,36.7 0 top
C18  88.01,27.05 270 top
C19  54.86,22.61 0 top
CON1  67.82,6.6 0 top
CON2  38.61,6.6 180 top
CON3  68.07,80.01 0 top
CON4  38.86,80.01 180 top
CUR_SENSE  59.18,40.89 270 top
IC1  35.81,47.5 270 top
IC2  59.44,50.29 270 top
IC3  34.29,25.15 270 top
J1  3.43,25.53 90 top
JP3  65.53,25.91 90 top
L1  80.9,17.53 0 top
PWR  80.01,69.6 90 top
R1  72.9,49.28 90 top
R2  72.9,44.58 270 top
R3  68.58,48.51 0 top
R4  81.53,64.39 270 top
R5  50.8,44.58 0 top
R6  63.5,41.53 180 top
R7  63.5,39.24 180 top
R8  51.82,23.49 0 top
R9  85.09,30.86 270 top
R10  80.14,39.12 180 top
R11  75.95,39.12 180 top
SL1  82.55,46.1 90 top
SL2  82.55,54.86 90 top
U1  53.09,30.73 90 top
U$1  -0.25,15.49 0 top
U$2  4.83,66.8 0 top
U$4  55.88,71.63 270 bottom
U$5  59.44,73.15 270 bottom
U$6  62.74,74.42 270 bottom
U$7  66.55,74.68 270 bottom
U$8  69.85,71.63 270 top
U$9  73.28,73.41 270 top
U$10  76.84,74.68 270 top
U$11  80.39,74.93 270 top
U$12  26.67,74.68 270 top
U$13  29.97,73.66 270 top
U$14  33.66,72.64 270 top
U$15  37.08,71.63 270 top
U$16  39.62,74.68 270 bottom
U$17  44.07,73.66 270 bottom
U$18  47.5,72.64 270 bottom
U$19  51.05,71.63 270 bottom
U$20  55.37,12.19 90 bottom
U$21  59.18,12.19 90 top
U$22  62.48,12.19 90 top
U$23  66.04,12.19 90 bottom
U$24  69.6,12.19 90 bottom
U$25  72.9,12.19 90 bottom
U$26  76.45,12.19 90 bottom
U$27  80.01,12.19 90 bottom
U$28  26.42,12.19 90 bottom
U$29  29.97,12.19 90 bottom
U$30  33.27,12.19 90 bottom
U$31  36.58,12.19 90 bottom
U$32  39.88,12.19 90 bottom
U$33  43.82,12.19 90 top
U$34  47.37,12.19 90 top
U$35  50.8,12.19 90 bottom
U$36  80.52,30.86 180 top
Y1  58.93,24 90 top

### Tracks (layer width: path | path; a pad name or v marks a point on that pad's centre or on a via)
1A  (via drill 0.6)
  Top 0.305: IC2.2 57.02,54.74 57.4,54.36 v57.4,51.82 | v52.07,28.19 51.31,28.19 50.29,27.18 U1.1
  Bottom 0.305: v57.4,51.82 57.4,44.2 54.1,40.89 54.1,30.23 v52.07,28.19
1Y
  Top 0.61: R2.2 72.94,42.97 C5.2
  Top 1.016: IC2.3 C3.1
  Bottom 1.016: C3.1 61.21,53.47 64.26,48.51 71.12,48.51 76.2,44.32 C5.2 76.28,44.4 SL1.2
4A  (via drill 0.6)
  Top 0.305: IC2.19 62.36,54.74 61.47,53.85 v61.47,50.29 | v47.24,26.67 U1.32
  Bottom 0.305: v61.47,50.29 59.94,48.9 59.56,48.51 59.56,44.07 56.01,40.64 56.01,28.19 53.34,26.67 v47.24,26.67
4Y
  Top 1.016: SL1.1 82.53,48.03 C5.1 76.24,50.13 R1.2 69.56,53.47 C2.1 IC2.18
+3V3  (via drill 0.6)
  Top 0.305: U$1.P9-4 21.34,19.81 22.61,18.67 25.15,18.67 52.32,18.67 53.09,19.3 53.09,22.95 | 53.09,22.95 R8.2 | R8.2 52.67,26.42 U1.4 52.58,26.55 52.58,27.18 53.09,27.94 53.21,27.94 | U1.6 54.29,27.5 53.85,27.94 53.21,27.94 | JP3.2 62.99,21.59 54.48,21.59 R8.2 | U1.18 55.09,34.26 54.86,34.04 53.85,34.04 | 53.85,34.04 53.59,34.29 53.59,34.92 U1.20 | 53.21,27.94 53.21,28.7 52.07,29.59 52.07,32.89 53.85,34.04 | 53.09,22.95 53.99,22.95 C19.1
  Top 0.406: C10.1 35.81,58.93 33.53,55.94 | IC1.2 33.53,55.94 | 33.53,55.94 33.53,49.02 32.39,47.5 IC1.15 29.97,47.5 29.72,47.75 v26.16,47.75 | IC3.15 C8.1 26.42,23.49 25.15,22.22 25.15,18.67 | IC3.2 26.22,33.6 v26.16,34.04
  Top 0.813: U$1.P9-3 U$1.P9-4
  Bottom 0.406: v26.16,47.75 v26.16,34.04 26.16,33.02 22.61,29.46 22.61,27.3 22.73,27.18 24.51,27.18 25.65,26.04 26.16,25.4 C8.1
BB_UART1_RX
  Top 0.305: U1.31 46.39,28.73 45.97,28.32 45.97,23.24 U$1.P9-26
BB_UART1_TX
  Top 0.305: U1.30 45.92,29.53 45.34,28.96 45.34,21.34 U$1.P9-24
BEMF_MEASURE  (via drill 0.6)
  Top 0.305: C1.1 69.22,45.63 69.22,44.2 67.82,42.8 v54.74,42.8 | v51.18,36.45 51.09,36.35 U1.23
  Top 0.61: C1.1 R3.2 72.81,48.51 R1.1 R2.1
  Bottom 0.305: v51.18,36.45 53.21,38.48 53.21,41.28 v54.74,42.8
CS  (via drill 0.6)
  Top 0.254: v60.07,35.31 60.07,37.21 59.94,37.34 53.21,37.34 52.71,37.85 43.69,37.85 38.86,42.67 v38.86,42.93 | v36.45,23.74 36.83,24.13 37.72,25.02 38.94,25.02 IC3.18
  Top 0.305: v38.86,42.93 38.86,47.12 39.24,47.5 IC1.18 | U1.10 57.41,28.7 v60.07,28.7
  Bottom 0.254: 38.86,37.08 38.86,26.92 v36.45,23.74
  Bottom 0.305: 38.86,37.08 v38.86,42.93 | v60.07,28.7 v60.07,35.31
CURR_MEASURE  (via drill 0.6)
  Top 0.305: R7.1 64.35,38.7 63.5,37.85 61.72,37.85 61.21,38.35 53.98,38.35 53.47,38.86 51.69,38.86 51.31,39.24 v50.29,39.24 | v50.29,33.4 U1.24
  Top 0.61: C13.1 64.87,39.77 R7.1
  Bottom 0.305: v50.29,39.24 v50.29,33.4
GND  (via drill 0.6)
  Top 0.406: IC2.17 IC2.16 IC2.15
  Top 0.61: R3.1 C1.2 | R6.1 67.33,41.53 C13.2
  other vias: 36.07,44.2 48.64,35.05 47.62,25.02 68.45,22.22 61.21,23.62 80.52,30.86 78.11,31.75 78.11,30.1 82.93,30.99 62.36,33.53 51.31,25.02 31.75,33.53 46.1,32.77 34.29,25.15 32.39,24.13 29.85,36.2 28.45,36.2 75.69,31.75 73.03,31.75 73.03,29.21 73.03,26.54 84.58,25.15 87.88,31.11 86.74,34.04 50.67,31.62 51.05,30.48 48.13,23.11 28.32,41.91 32.39,42.93 30.73,39.88 47.37,30.35 27.77,26.11 66.04,41.4 54.36,24.26
  pour Top (isolate 0.254, rank 2, no thermals): 54.36,48.06 54.36,52.52 56.39,52.52 56.39,48.06
  pour Top (isolate 0.254, rank 2, no thermals): 64.52,48.06 64.52,52.53 62.23,52.53 62.23,48.06
  pour Top (isolate 0.254, rank 2): -6.35,88.14 -6.1,88.39 88.65,88.39 91.57,86.87 91.57,0 87.38,-2.79 -4.83,-2.79 -11.18,3.56 -11.18,83.82
  pour Bottom (rank 2): -7.62,88.39 -7.37,88.14 90.42,88.14 91.69,86.87 91.69,-3.05 90.93,-3.81 -9.4,-3.81
MISO  (via drill 0.6)
  Top 0.254: JP3.1 64.26,27.18 56.64,27.18 55.12,28.7 54.1,29.84 | 54.1,32.89 53.47,32.89 v53.09,32.51 | 46.02,34.25 v46.1,34.16
  Top 0.305: 54.1,29.84 54.1,32.89 54.99,33.53 U1.16 | IC3.32 46.02,34.25
  Bottom 0.254: v53.09,32.51 47.75,32.51 v46.1,34.16
MOSI
  Top 0.254: 61.34,32.77 61.34,37.21 60.71,37.85 53.47,37.85 52.96,38.35 43.94,38.35 40.59,41.7 IC1.17
  Top 0.305: U1.15 57.41,32.77 61.34,32.77 61.34,30.23 62.99,28.7 JP3.4
N$1  (via drill 0.6)
  Top 0.406: v36.83,30.99 IC3.27
  Top 0.61: v28.19,38.23 22.1,38.23 22.1,53.09 22.22,53.21 22.22,54.86 19.68,57.53 12.7,57.53 8.64,61.59 8.64,74.4 BANK34.1
  Bottom 0.61: v28.19,38.23 31.24,38.23 v36.83,30.99
N$2  (via drill 0.6)
  Top 0.406: IC3.23 36.88,28.4 v36.83,28.45
  Top 0.61: v27.05,37.21 21.21,37.21 21.21,53.85 21.34,53.98 21.34,54.61 19.3,56.77 12.06,56.77 7.75,61.21 7.75,77.01 BANK34.2
  Bottom 0.406: 36.7,28.57 v36.83,28.45
  Bottom 0.61: v27.05,37.21 30.61,37.21 36.7,29.59 36.7,28.57
N$3
  Top 0.406: IC3.6 27.82,31
  Top 0.61: BANK12.2 10.75,18.11 21.21,28.32 25.15,28.32 27.82,31
N$4
  Top 0.406: BANK12.1 14.22,6.6 13.84,6.6
  Top 0.508: 26.36,28.4 IC3.10
  Top 0.61: 14.22,6.6 14.22,18.92 22.86,27.56 25.53,27.56 26.36,28.4
N$5
  Top 0.305: CUR_SENSE.3 53.53,41.84 52.32,42.93 52.32,44.45 R5.2
  Top 1.016: IC2.10 R5.2 55.98,44.58
N$6
  Top 0.61: CUR_SENSE.1 R6.2 R7.2
N$7  (via drill 0.6)
  Top 0.406: IC1.22 39.06,50.1 v38.61,50.29
  Top 0.61: v41.4,14.73 42.94,13.19 U$33.C 43.69,13.46 44.7,14.48 61.2,14.48 U$22.C
  Bottom 0.61: U$6.C 62.21,73.42 60.96,74.68 60.96,82.8 59.69,84.07 47.24,84.07 45.97,82.8 45.97,73.93 U$17.C 23.89,72.66 23.88,72.64 13.84,72.64 11.05,69.85 11.05,62.48 14.1,59.44 26.16,59.44 36.32,50.55 36.58,50.29 v38.61,50.29 42.16,47.24 42.16,22.1 40.39,20.7 40.39,15.75 v41.4,14.73
N$8  (via drill 0.6)
  Top 0.406: v37.08,47.75 38.53,49.45 IC1.21
  Bottom 0.61: U$7.C 64.52,75.71 64.52,82.8 61.98,85.34 44.96,85.34 42.42,82.8 42.42,75.69 40.4,73.68 U$16.C 23.89,73.68 | 23.89,73.68 23.88,73.66 | 23.89,73.68 13.61,73.68 10.29,70.36 10.29,61.98 13.84,58.42 24.64,58.42 27.69,55.37 v37.08,47.75 41.4,44.32 41.4,22.48 38.99,22.48 37.85,21.34 37.85,15.24 39.88,13.21 U$32.C 39.86,13.19 42.16,11.18 42.16,5.59 43.18,4.83 62.99,4.83 64.26,5.33 64.26,11.41 U$23.C
N$9  (via drill 0.6)
  Top 0.406: v26.52,54 26.16,54.36
  Top 0.61: U$8.C U$15.C 14.37,70.63 12.57,68.83 12.57,63.5 14.61,61.47 21.84,61.47 26.16,57.15 26.16,54.36 | IC1.5 v26.52,54
  Bottom 0.406: v26.52,54 26.65,54 26.67,53.98
  Bottom 0.61: 26.67,53.98 40.51,43.05 40.64,23.24 38.35,23.24 37.08,21.97 36.2,21.97 35.31,21.08 35.31,15.88 36.59,13.19 U$31.C 36.31,13.19 38.61,11.43 38.61,5.08 40.13,3.81 65.53,3.81 67.82,5.84 67.82,11.41 U$24.C
N$10
  Bottom 0.61: U$6.A 62.74,79.93 CON3.3
N$11  (via drill 0.6)
  Top 0.406: IC1.28 39.39,54 v38.61,53.98
  Bottom 0.61: U$4.C U$19.C 14.37,70.63 12.57,68.83 12.57,63.5 14.61,61.47 29.46,61.47 v38.61,53.98 43.69,49.53 43.69,23.62 45.47,22.35 45.47,16.51 47.5,14.48 49.53,14.48 50.82,13.19 U$35.C U$20.C
N$12  (via drill 0.6)
  Top 0.254: 31.05,49.41 30.99,49.4 IC1.12
  Top 0.406: v23.11,49.4 23.11,49.53 | 29.59,49.4 31.05,49.41
  Top 0.61: U$11.C 79.49,73.93 78.74,74.68 78.74,83.82 77.22,85.34 32.26,85.34 28.45,81.53 28.45,75.45 U$12.C 13.61,73.68 10.29,70.36 10.29,61.98 13.84,58.42 20.07,58.42 23.11,55.37 23.11,49.53 | v23.11,49.4 29.59,49.4
  Bottom 0.61: v23.11,49.4 23.11,34.78 21.1,32.64 18.67,30.23 12.7,24.51 12.7,17.14 16.64,13.21 U$28.C 27.42,13.19 27.94,12.7 27.94,2.79 30.23,0.76 75.44,0.76 78.23,4.32 78.23,11.16 U$27.C
N$13  (via drill 0.6)
  Top 0.254: IC3.17 42.78,24.5 43.94,25.65 43.94,30.73 v45.21,31.5 | v37.97,56.52 38.06,56.6 IC1.32
  Bottom 0.305: v37.97,56.52 44.2,51.56 45.21,50.55 v45.21,31.5
N$14  (via drill 0.6)
  Top 0.254: IC1.11
  Top 0.406: 30.06,50.1 IC1.11
  Top 0.61: U$10.C 76.44,73.68 75.18,74.93 75.18,82.8 73.91,84.07 34.8,84.07 32,81.28 32,74.18 U$13.C 13.86,72.66 11.05,69.85 11.05,62.48 14.1,59.44 20.57,59.44 24.13,55.88 v24.13,50.67 29.21,50.67 30.06,50.1
  Bottom 0.406: 28.7,14.22 28.7,13.97 29.48,13.19
  Bottom 0.61: 29.48,13.19 U$29.C 29.96,13.19 31.5,11.43 31.5,3.05 32.77,1.78 73.15,1.78 74.93,3.3 74.93,10.91 U$26.C | 28.7,14.22 17.02,14.22 13.59,17.53 13.59,24 16.38,26.67 24,34.29 v24.13,50.67
N$15  (via drill 0.6)
  Top 0.406: v38.61,52.32 38.86,52.32 39.24,52.71 IC1.26
  Top 0.61: v45.72,13.21 45.74,13.19 U$34.C U$21.C
  Bottom 0.61: U$5.C 58.91,72.15 57.66,73.41 57.66,81.79 56.64,82.8 51.05,82.8 49.28,81.03 49.28,73.93 U$18.C 23.89,71.64 23.88,71.63 14.1,71.63 11.81,69.34 11.81,62.99 14.35,60.45 27.43,60.45 29.85,58.29 36.83,52.32 v38.61,52.32 42.93,48.51 42.93,16 v45.72,13.21
N$16  (via drill 0.6)
  Top 0.406: v25.15,52.7 v25.15,52.71
  Top 0.61: U$9.C 73.14,72.41 71.63,73.91 71.63,80.77 69.6,82.8 36.83,82.8 35.56,81.53 35.56,73.42 U$14.C 14.11,71.64 11.81,69.34 11.81,62.99 14.35,60.45 21.34,60.45 25.15,56.64 v25.15,52.71 | IC1.7 v25.15,52.7
  Bottom 0.61: v25.15,52.71 25.02,33.78 24.77,33.4 22.1,30.73 14.48,23.49 14.61,17.91 17.4,15.11 30.73,15.11 30.73,14.99 32.53,13.19 U$30.C 33.26,13.19 35.05,11.18 35.05,4.57 37.08,2.79 69.6,2.79 71.37,4.57 71.37,11.41 U$25.C
N$17  (via drill 0.6)
  Top 0.406: v27.18,32.13 13.34,32.13 12.57,31.37 J1.4 | IC3.20 37.24,26.45 v36.45,25.78
  Bottom 0.406: v27.18,32.13 30.35,32.13 30.86,32.51 33.27,32.51 35.69,29.46 35.69,26.54 v36.45,25.78
N$18
  Bottom 0.61: U$5.A 59.44,79.9 CON3.2
N$19
  Bottom 0.61: CON3.1 55.82,73.33 U$4.A
N$20
  Top 0.61: CON3.8 80.32,76.13 U$11.A
N$21
  Top 0.61: CON3.7 76.82,75.82 U$10.A
N$22
  Top 0.61: CON3.6 73.32,74.49 U$9.A
N$23
  Top 0.61: CON3.5 69.82,73.16 U$8.A
N$24
  Bottom 0.61: U$7.A 66.55,79.78 CON3.4
N$25
  Top 0.61: CON4.8 26.61,75.73 U$12.A
N$26
  Top 0.61: CON4.7 30.11,75.56 U$13.A
N$27
  Top 0.61: CON4.6 33.61,74.49 U$14.A
N$28
  Top 0.61: CON4.5 37.11,73.16 U$15.A
N$29
  Bottom 0.61: CON4.4 40.61,76.66 U$16.A
N$30
  Bottom 0.61: CON4.3 44.11,75.59 U$17.A
N$31
  Bottom 0.61: U$18.A 47.5,79.9 CON4.2
N$32
  Bottom 0.61: CON4.1 51.11,73.19 U$19.A
N$33
  Bottom 0.61: U$27.A 80.01,6.66 CON1.8
N$34
  Bottom 0.61: U$26.A 76.45,6.72 CON1.7
N$35
  Top 0.406: R4.1 81.6,65.47 PWR.A
N$36
  Bottom 0.61: U$25.A 72.9,6.77 CON1.6
N$37
  Bottom 0.61: U$24.A 69.6,6.63 CON1.5
N$38
  Bottom 0.61: U$23.A 66.04,6.63 CON1.4
N$39
  Top 0.61: U$22.A 62.48,6.69 CON1.3
N$40
  Top 0.61: U$21.A 59.18,6.72 CON1.2
N$41
  Bottom 0.61: U$20.A 55.37,6.8 CON1.1
N$42
  Bottom 0.61: U$28.A 26.42,6.66 CON2.8
N$43
  Bottom 0.61: U$29.A 29.97,6.72 CON2.7
N$44
  Bottom 0.61: U$30.A 33.27,6.69 CON2.6
N$45
  Bottom 0.61: U$31.A 36.58,6.89 CON2.5
N$46
  Bottom 0.61: U$32.A 39.88,7.08 CON2.4
N$47
  Top 0.61: U$33.A 43.86,11.02 CON2.3
N$48
  Top 0.61: U$34.A 47.36,10.82 CON2.2
N$49
  Bottom 0.61: U$35.A 50.8,6.66 CON2.1
N$50  (via drill 0.6)
  Top 0.406: v23.88,29.34 22.22,30.86 16.02,30.86 J1.5 | v31.24,26.16 30.83,26.45 IC3.13
  Bottom 0.406: v23.88,29.34 25.53,27.69 27.81,27.69 29.34,26.16 v31.24,26.16
N$51
  Bottom 0.406: 84.07,40.77 72.77,40.77 69.22,37.21 69.22,24.89 71.88,22.22 75.82,22.22 77.34,20.7 77.34,17.4
N$53
  Top 0.406: IC3.29 37.94,32.3 37.34,32.89 35.81,32.89 34.04,35.05 22.86,35.05 21.84,34.04 8.51,34.04 5.71,31.24 J1.2
N$54
  Top 0.406: IC3.3 29.44,33.02 11.18,33.02 10.54,32.64 J1.3
N$55
  Top 0.254: U1.7 55.09,25.18 57.53,22.73 58.86,22.73 Y1.1
N$56
  Top 0.254: U1.8 57.69,26.44 Y1.3
N$58
  Top 0.254: R9.1 84.65,31.71 U$36.1
N$59
  pour Top (no thermals): 81.53,27.81 80.77,27.81 80.77,26.42 81.28,26.04 82.55,26.04 82.42,26.42 81.79,26.42 81.66,26.54 81.66,27.56
N$60
  Top 0.254: U$36.4 75.14,33.93 C16.2
N$61
  Top 1.016: L1.P$1 C14.2 79.9,27.79 U$36.6
N$63
  Top 0.254: C15.2 79.12,36.45 79.88,35.69 U$36.3
N$65
  Top 0.254: U$36.2 81.17,33.95 C17.1 80.14,36.7 79.38,37.47 79.38,39.03 R10.2 R11.1
NC
  Top 0.254: 69.22,37.21 69.34,37.34
  Top 0.406: 69.22,37.21 69.22,24.89 71.88,22.22 75.82,22.22 77.34,20.7 77.34,17.4 | 69.34,37.34 72.77,40.77 84.07,40.77
PWM1  (via drill 0.6)
  Top 0.305: IC2.1 57.91,56.01 58.42,55.25 v58.42,50.42 | v55.12,30.99 57.23,30.99 U1.13
  Bottom 0.305: v58.42,50.42 58.42,44.2 55.12,40.89 v55.12,30.99
PWM2  (via drill 0.6)
  Top 0.305: IC2.11 v61.72,44.58 | v59.05,32 57.31,32 U1.14
  Bottom 0.305: v61.72,44.58 61.72,42.55 60.2,38.73 57.79,38.73 57.79,35.43 58.55,34.8 59.05,34.29 v59.05,32
RESET  (via drill 0.6)
  Top 0.254: R8.1 v49.4,25.18 49.4,27.05 50.29,27.94 50.29,29.72 49.68,30.33 U1.29
  Bottom 0.254: JP3.5 65.79,30.99 67.06,29.72 67.06,23.62 65.15,21.72 50.8,21.72 49.53,22.99 49.53,25.06 v49.4,25.18
SCK  (via drill 0.6)
  Top 0.254: 46.99,37.34 52.32,37.34 53.09,36.58 55.88,36.58 | 46.99,37.34 46.99,31.24 44.45,30.1 44.45,23.75 42.55,21.84 32.16,21.84 IC3.16 | 46.99,37.34 43.56,37.34 38.74,42.04 35.81,42.04 31.03,46.82 IC1.16
  Top 0.305: U1.17 55.88,36.58 v58.8,36.58 | IC1.16 28.96,46.85 C11.1
  Bottom 0.305: JP3.3 64.26,29.72 64.26,33.02 60.71,36.58 v58.8,36.58
SYS_5V
  Bottom 0.813: U$1.P9-7 U$1.P9-8
V+  (via drill 0.6)
  Top 0.254: 49.53,44.45 49.53,43.69 52.32,40.89 57.13,40.89 CUR_SENSE.2
  Top 0.305: 49.53,44.45 R5.1
  Top 0.406: SL2.1 82.55,62.93 R4.2 | 46.74,44.45 v46.99,44.7 | 31.11,30.35 IC3.7 | 31.11,30.35 35.69,30.35 36.07,29.97 37.47,29.97 37.85,30.35 IC3.26 40.89,30.35 | IC3.11 30.79,27.75 31.11,28.19 31.11,30.35 | IC3.22 40.19,27.75
  Top 0.61: C6.+ 45.59,56.52 45.03,55.95 IC1.31 | C9.+ 35.94,36.45 | 35.94,36.45 35.94,35.43 37.78,33.6 IC3.31 40.19,33.6 40.89,32.89 40.89,30.35 | v46.1,36.45 35.94,36.45 | 40.89,30.35 40.89,28.57 40.19,27.75 | 40.89,30.35
  Top 1.016: R5.1 49.27,44.7 v46.99,44.7 v46.99,45.97
  Top 1.27: 85.09,28.19 R9.2
  Bottom 1.016: v46.99,44.7 46.99,54.1 51.05,57.66 | 51.05,57.66 C7.+ 81.05,57.79 SL2.1 | v46.99,45.97 v46.99,44.7 | v46.99,44.7 46.99,36.45 v46.1,36.45 | C6.+ 51.05,57.66
  Bottom 1.27: SL2.1 85.07,54.51 85.09,53.72 85.09,28.32
  other vias: 83.31,27.43 84.07,28.32 83.95,29.46 85.6,28.32 84.71,27.43
  pour Top (no thermals): 82.17,28.07 82.17,28.45 83.82,30.1 85.73,30.1 86.11,29.72 86.11,27.3 85.73,26.92 82.17,26.92
  pour Bottom (no thermals): 82.17,28.07 82.17,28.45 83.82,30.1 85.73,30.1 86.11,29.72 86.11,27.3 85.73,26.92 82.17,26.92
VDD_5V  (via drill 0.6)
  Top 0.254: C18.2 88.52,25.55 | R10.1 83.17,36.93 C17.2 87.76,36.7 90.04,34.04 90.04,27.07 89.65,26.68
  Top 0.406: U$1.P9-6 23.88,22.48 24.51,23.11 25.15,23.88 25.15,26.16 26.08,27.1 IC3.12 31.41,27.1 v31.75,27.3 32,27.3 32.64,26.67 36.45,26.67 37.08,27.05 37.13,27.1 IC3.21 | IC3.5 32.79,31.65 | 32.79,31.65 35.58,31.65 35.94,32 37.34,32 37.7,31.65 IC3.28 | 32.79,31.65 v31.75,31.62 | IC2.20 64.47,59.23 C4.+ 68.71,59.44 74.68,53.47 76.71,53.47 79.76,50.42 83.06,50.42 85.22,48.26 85.22,41.15 90.68,34.93 90.68,27.71 89.65,26.68 88.52,25.55
  Top 0.61: IC2.20 64.26,56.23 C4.+ C12.1
  Top 0.813: U$1.P9-5 23.88,17.14 25.15,15.88 84.85,15.88 L1.P$2
  Top 1.016: L1.P$2 88.01,19.03 C18.2
  Bottom 0.406: v31.75,31.62 v31.75,27.3
  Bottom 0.813: U$1.P9-5 U$1.P9-6

### Text on the board
tPlace: 9-12 | 13-16 | 9A | 9B | 10A | 10B | 11A | 11B | 12A | 12B | 13A | 13B | 14A | 14B | 15A | 15B | 16A | 16B | Turnouts | Turnouts | (c) E. Lafargue 2013 | COM / (+10V) | + | R4 | C4 | C7 | C6 | C12 | C10 | aerodynes.org | PWR | + | Train Controller v3.0 | IC3 | IC2 | C2 | C3 | + | R1 | R3 | 10 VDC Max | R5 | C11 | C1 | R2 | Track | R6 | CurSense | C13 | C5 | R7 | R11 | R10 | C9 | C17 | IC1 | U1 | C15 | C16 | GND | R9 | Relay out | C18 | R1 | Y1 | R2 | C14 | C19 | +5V | C8 | R8 | R3 | R4 | L1 | Turnouts | Turnouts | COM (+10V) | 1A | 1B | 2A | 2B | 3A | 3B | 4A | 4B | 5A | 5B | 6A | 6B | 6B | 7A | 7B | 8A | 8B | 1-4 | 5-8